# EAGLE design PaxInstruments-T100 (EAGLE 7.0.0)
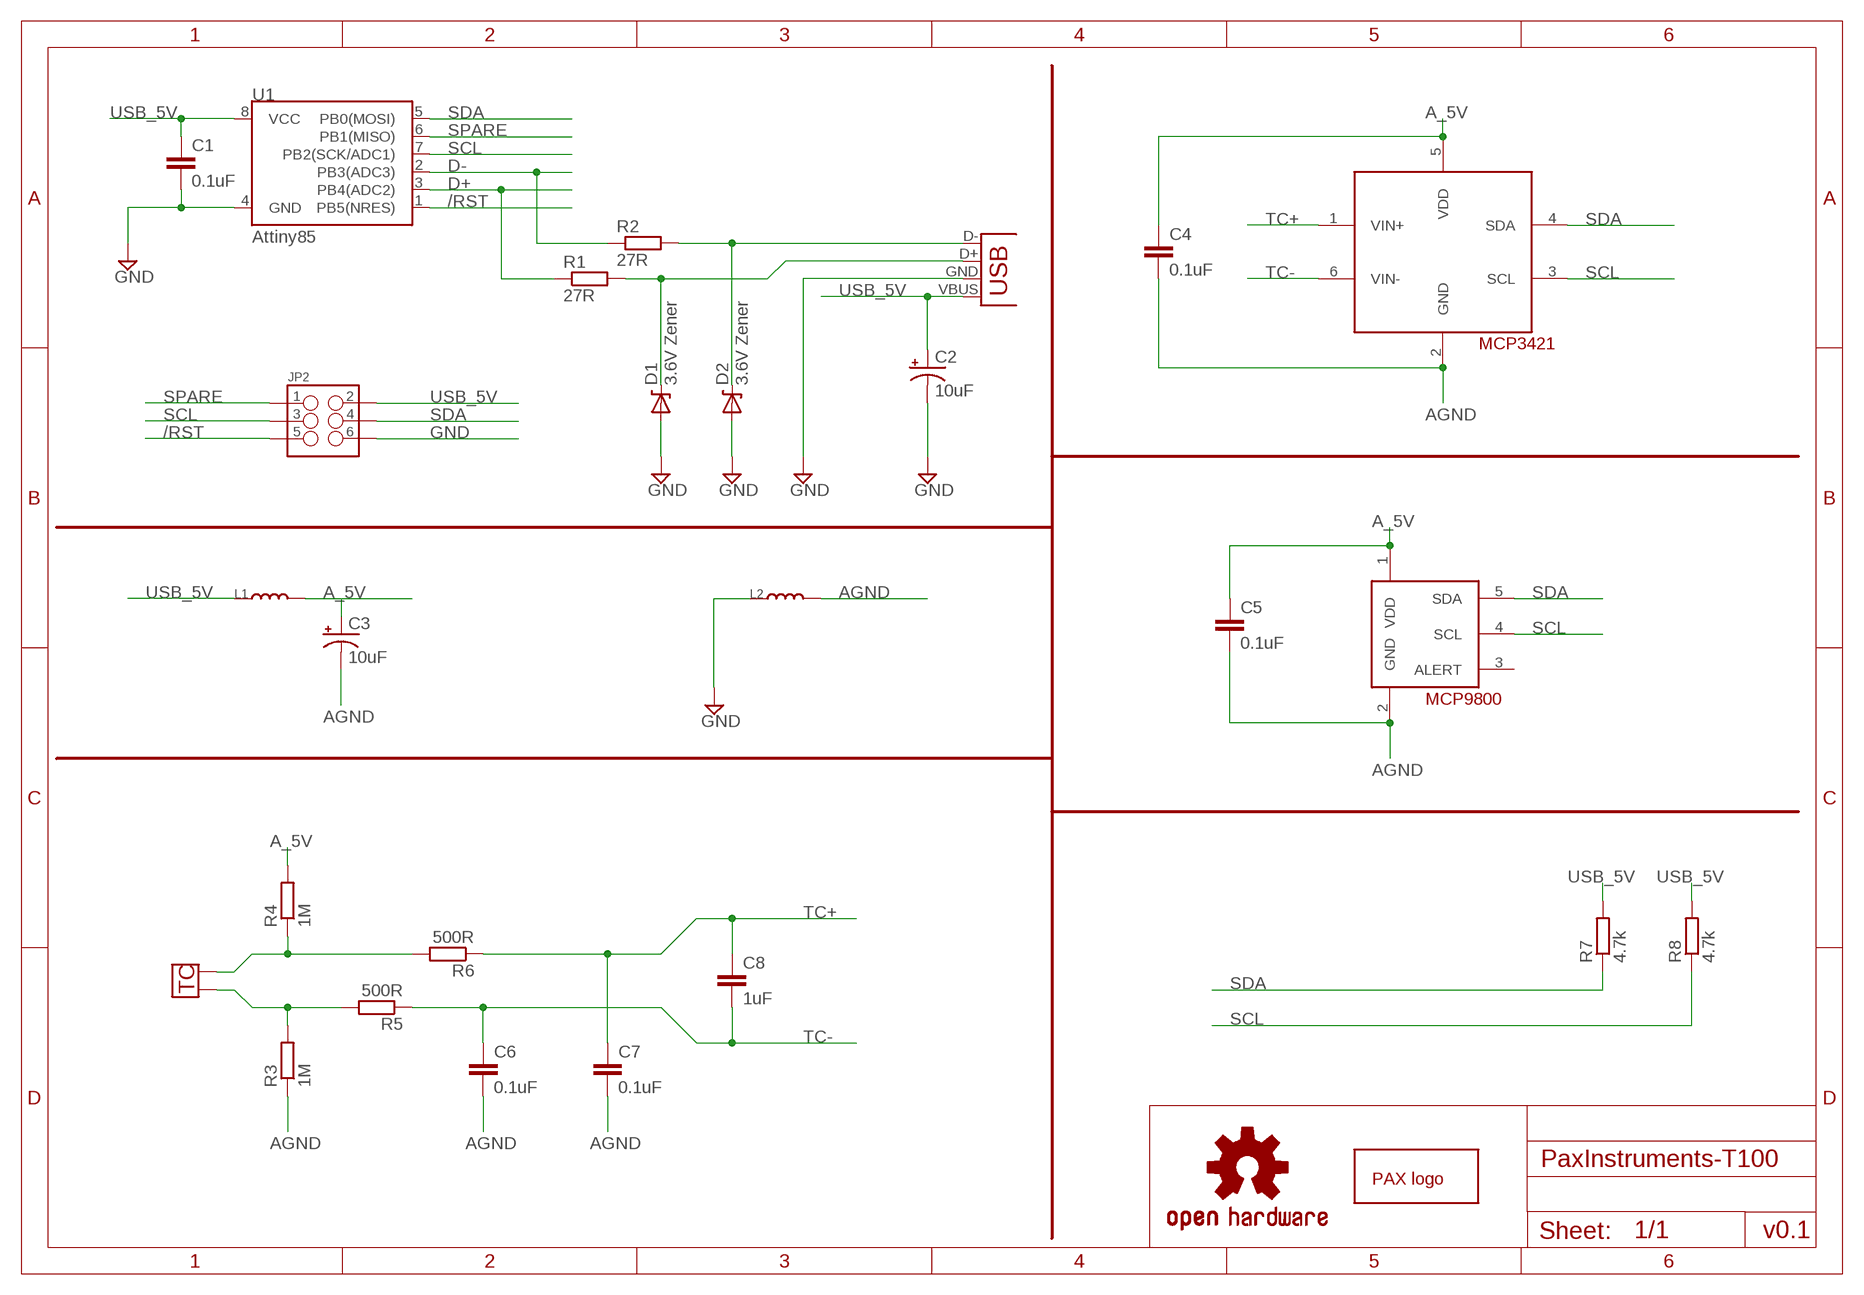
[diagram p0: schematic, sheet 1]

## Parts
C1  0.1uF  C-EUC0603  [C0603]
C2  10uF  10UF-TANT  [EIA3216]
C3  10uF  10UF-TANT  [EIA3216]
C4  0.1uF  C-EUC0603  [C0603]
C5  0.1uF  C-EUC0603  [C0603]
C6  0.1uF  C-EUC0603  [C0603]
C7  0.1uF  C-EUC0603  [C0603]
C8  1uF  C-EUC0603  [C0603]
D1  3.6V Zener  DIODE-ZENER-BZT52  [SOD-323]
D2  3.6V Zener  DIODE-ZENER-BZT52  [SOD-323]
JP1  USB-A-H  [USB-A-H]
JP2  M03X2SMT  [2X3_SMT_POSTS]
L1  L-0603  [L0603]
L2  L-0603  [L0603]
LOGO1  OSHW-LOGOS  [OSHW-LOGO-S]
R1  27R  R-EU_R0603  [R0603]
R2  27R  R-EU_R0603  [R0603]
R3  1M  R-EU_R0603  [R0603]
R4  1M  R-EU_R0603  [R0603]
R5  500R  R-EU_R0603  [R0603]
R6  500R  R-EU_R0603  [R0603]
R7  4.7k  R-EU_R0603  [R0603]
R8  4.7k  R-EU_R0603  [R0603]
U1  Attiny85  ATTINY45TINY45-20-SMT  [SO08-EIAJ]
U$1  PAX-LOGO  [PAX-LOGO]
U$2  TC-MINI-CONNECTOR  [TC-MINI-CONNECTOR]
U$3  MCP3421  [SOT23-6]
U$4  MCP9800  [SOT23-5]

## Nets
/RST: JP2.5 U1.1(PB5(NRES))
A_5V: C3.A(+) C4.1 C5.1 L1.2 R4.2 U$3.5(VDD) U$4.1(VDD)
AGND: C3.C(-) C4.2 C5.2 C6.2 C7.2 L2.2 R3.1 U$3.2(GND) U$4.2(GND)
D+: R1.1 U1.3(PB4(ADC2))
D-: R2.1 U1.2(PB3(ADC3))
GND: C1.2 C2.C(-) D1.2(A) D2.2(A) JP1.GND(VBUS) JP2.6 L2.1 U1.4(GND)
N$1: D2.1(C) JP1.D-(D+) R2.2
N$2: D1.1(C) JP1.D+(D-) R1.2
N$3: R3.2 R5.2 U$2.P$2
N$4: R4.1 R6.2 U$2.P$1
SCL: JP2.3 R8.1 U1.7(PB2(SCK/ADC1)) U$3.3(SCL) U$4.4(SCL)
SDA: JP2.4 R7.1 U1.5(PB0(MOSI)) U$3.4(SDA) U$4.5(SDA)
SPARE: JP2.1 U1.6(PB1(MISO))
TC+: C7.1 C8.1 R6.1 U$3.1(VIN+)
TC-: C6.1 C8.2 R5.1 U$3.6(VIN-)
USB_5V: C1.1 C2.A(+) JP1.VBUS(GND) JP2.2 L1.1 R7.2 R8.2 U1.8(VCC)
Unconnected: U$4.3(ALERT)

## Notes on the sheet
- v0.1

## Library data of the parts
C1 C4-C8 = rcl:C-EU: CAPACITOR, European symbol
C2 C3 = SparkFun-Capacitors:10UF-TANT: 10uF Tantalum SMT CAP-00811- 16V 10% (EIA-3216); PROD_ID: CAP-00811
D1 D2 = SparkFun-DiscreteSemi:DIODE-ZENER: Zener Diode Production Part - 8199 3.4V Zener Voltage
JP1 = SparkFun-Connectors:USB: USB Connectors USB-B-PTH is fully proven SKU : PRT-00139/CONN-08278 USB-miniB is fully proven SKU : PRT-00587 USB-A-PCB is untested. USB-A-H is throughly reviewed, but untested. Spark Fun Electronics SKU : PRT-00437 USB-B-SMT is throughly reviewed, but untested. Needs silkscreen touching up. USB-A-S has not been used/tested USB-MB-H has not been used/tested USB-MICROB has been used. CONN-09505
JP2 = SparkFun-Connectors:M03X2: 2x3 .1" header. Shrouded, with keying- CONN-10681 SMT- CONN-11415 Pogo pins- HW-11044; PROD_ID: CONN-11415
L1 L2 = SeeesStudio-OPL:L*
LOGO1 = SparkFun-Aesthetics:OSHW-LOGO: Open Source Hardware Logo This logo indicates the piece of hardware it is found on incorporates a OSHW license and/or adheres to the definition of open source hardware found here: http://freedomdefined.org/OSHW
R1-R8 = rcl:R-EU_: RESISTOR, European symbol
U1 = SparkFun-DigitalIC_ihsan:ATTINY45: Atmel 8-pin 2/4/8kB flash uC; PROD_ID: IC-08922; VALUE: Tiny45-20-SMT
U$1 = charlespax:PAX-LOGO
U$2 = charlespax:TC-MINI-CONNECTOR
U$3 = SparkFun-DigitalIC:MCP3421
U$4 = SparkFun-DigitalIC:MCP9800

## Board
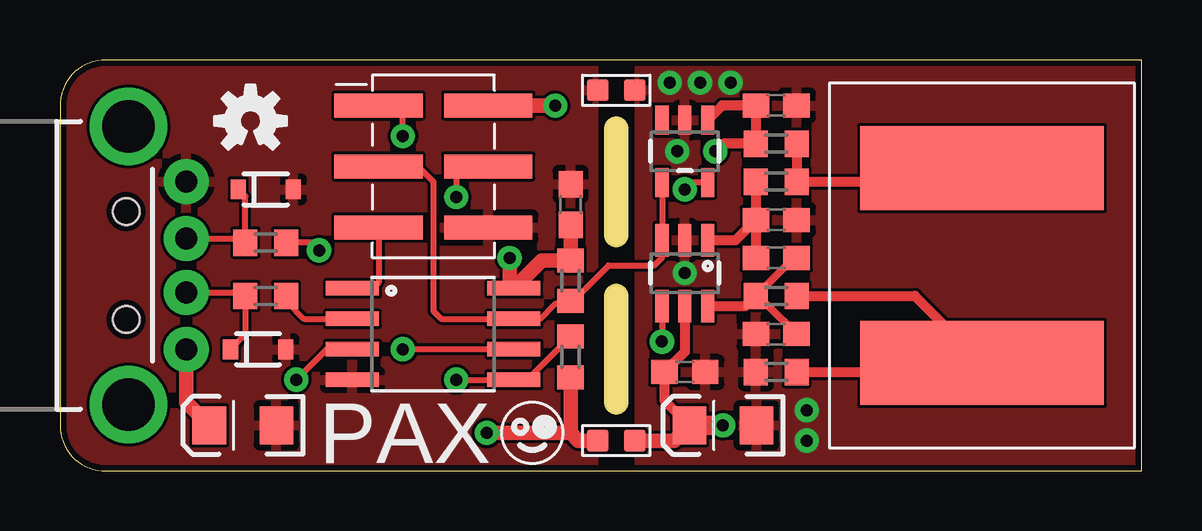
[diagram p1: board, top side]
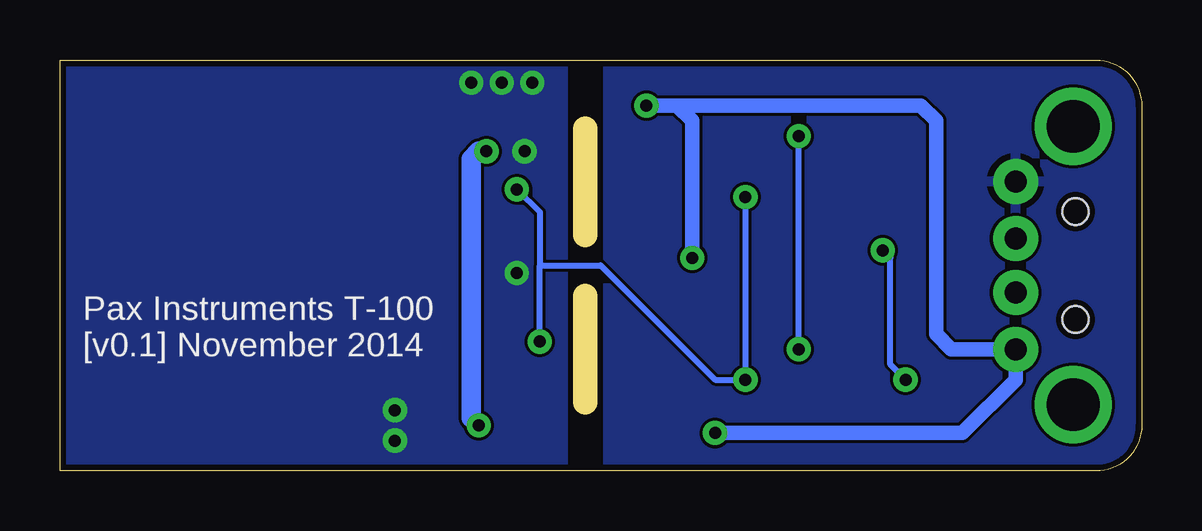
[diagram p2: board, bottom side, seen from below]

Size 45.07 x 17.14 mm. Coordinates in mm from the lower left corner, seen from the top.
Outline: 0,1.91 arc90 1.91,0 45.07,0 45.07,17.14 2.22,17.14 1.92,17.14 arc90 0,15.23 0,1.91
Copper layers (1*16): Top 0.035mm / dielectric 1.5mm / Bottom 0.035mm
Design rules "PaxInstrument-T400": minimum track width 6mil, minimum drill 13mil, track to track 5mil, track to pad 5mil, pad to pad 5mil, via to via 5mil, smd to smd 5mil, copper to edge 10mil, drill to drill 8mil, minimum pad ring 12mil, minimum via ring 10mil, stop-mask expansion 4mil, vias tented up to drill 25mil, thermal gap 10mil
Milling: 2 lines

### Footprints (pad centres in the part's own frame; a part is rotated, then mirrored left to right if it is on the bottom)
C0603 = smd 1.1 x 1: 1 -0.85,0; 2 0.85,0
EIA3216 = smd 1.4 x 1.6: A 1.4,0; C -1.4,0
SOD-323 = smd 0.63 x 0.83: 1 -1.15,0; 2 1.15,0
USB-A-H = drill 0.914 pad 1.88: D+ 2.4,1.127; D- 2.4,-1.127; GND 2.4,3.5; VBUS 2.4,-3.5 | drill 2.2: GND2 0,-5.8; GND3 0,5.8 | hole 1.1: -0.1,2.25; -0.1,-2.25
2X3_SMT_POSTS = smd 1 x 3.683: 1 -2.54,-2.286; 2 -2.54,2.286; 3 0,-2.286; 4 0,2.286; 5 2.54,-2.286; 6 2.54,2.286
L0603 = smd 0.889 x 0.889: 1 -0.762,0; 2 0.762,0
R0603 = smd 1 x 1.1: 1 -0.85,0; 2 0.85,0
SO08-EIAJ = smd 0.61 x 2.21: 1 -1.905,-3.378; 2 -0.635,-3.378; 3 0.635,-3.378; 4 1.905,-3.378; 5 1.905,3.353; 6 0.635,3.353; 7 -0.635,3.353; 8 -1.905,3.353
TC-MINI-CONNECTOR = smd 3.505 x 10.16: P$1 4.064,0; P$2 -4.064,0
SOT23-6 = smd 0.55 x 1.35: 1 -0.95,-1.375; 2 0,-1.375; 3 0.95,-1.375; 4 0.95,1.375; 5 0,1.375; 6 -0.95,1.375
SOT23-5 = smd 0.55 x 1.2: 1 -0.95,-1.3; 2 0,-1.3; 3 0.95,-1.3; 4 0.95,1.3; 5 -0.95,1.3

### Placement (x,y rotation side)
C1  21.27,11.11 90 top
C2  7.62,1.91 180 top
C3  27.62,1.91 180 top
C4  26.04,4.13 0 top
C5  29.84,15.24 0 top
C6  29.84,5.71 180 top
C7  29.84,10.48 0 top
C8  29.84,8.89 0 top
D1  8.57,11.75 0 top
D2  8.26,5.08 0 top
JP1  2.86,8.57 0 top
JP2  15.56,12.7 270 top
L1  23.18,1.27 0 top
L2  23.18,15.88 0 top
LOGO1  7.94,14.61 0 top
R1  8.57,9.53 180 top
R2  8.57,7.3 180 top
R3  29.84,4.13 0 top
R4  29.84,13.65 180 top
R5  29.84,7.3 0 top
R6  29.84,12.06 0 top
R7  21.27,4.76 270 top
R8  21.27,7.94 90 top
U1  15.56,5.71 270 top
U$1  10.79,0.32 0 top
U$2  38.42,8.57 90 top
U$3  26.04,8.26 180 top
U$4  26.04,13.34 180 top

### Tracks (layer width: path | path; a pad name or v marks a point on that pad's centre or on a via)
/RST
  Top 0.254: JP2.5 13.27,7.87 13.02,7.62 U1.1
A_5V  (via drill 0.5)
  Top 0.406: U$3.5 26.04,4.98 C4.1 25.18,2.94 C3.A | U$4.1 27.59,15.24 C5.1 R4.2 27.62,13.65 v27.3,13.34
  Top 0.61: L1.2 25.59,1.27 C3.A
  Top 0.813: v27.62,1.91 C3.A
  Bottom 0.813: v27.3,13.34 27.62,13.34 27.94,13.02 27.94,2.22 v27.62,1.91
AGND  (via drill 0.5)
  other vias: 26.04,8.26 25.72,13.34 25.4,16.19 31.11,1.27 31.11,2.54 26.67,16.19 27.94,16.19
  pour Top: 24.13,17.14 24.13,0 45.09,0 45.09,17.14
  pour Bottom: 24.13,17.14 24.13,0 45.09,0 45.09,17.14
D+  (via drill 0.5)
  Top 0.254: U1.3 11.11,5.08 v9.84,3.81 | v10.79,9.21 10.48,9.53 R1.1
  Bottom 0.254: v9.84,3.81 10.48,4.45 10.48,8.89 v10.79,9.21
D-
  Top 0.254: R2.1 9.42,7.09 10.16,6.35 U1.2
GND
  pour Bottom: 0,17.14 0,0 22.23,0 22.23,17.14
  pour Top: 0,17.14 22.23,17.14 22.23,0 0,0
N$1
  Top 0.254: JP1.D- 7.58,7.45 R2.2 7.72,5.7 D2.1
N$2
  Top 0.254: D1.1 7.72,11.45 R1.2 7.55,9.7 JP1.D+
N$3
  Top 0.406: R5.2 35.62,7.3 U$2.P$2 38.04,4.13 R3.2
N$4
  Top 0.406: 38.99,13.34 U$2.P$1 37.85,12.06 R6.2 R4.1
SCL
  Top 0.254: JP2.3 14.92,12.7 15.56,12.06 15.56,6.67 15.88,6.35 U1.7 20,6.35 20.64,6.99 21.17,6.99 R8.1 21.38,7.09 22.86,8.57 24.77,8.57 25.08,8.89 U$3.3 U$4.4
SDA  (via drill 0.5)
  Top 0.254: JP2.4 16.83,12.7 16.51,12.38 v16.51,11.43 | v16.51,3.81 U1.5 19.47,3.81 R7.1 | U$3.4 25.09,6.04 25.08,5.71 v25.08,5.4 | U$4.5 26.32,12.04 v26.04,11.75
  Bottom 0.254: v16.51,11.43 v16.51,3.81 17.78,3.81 22.54,8.57 25.08,8.57 | v25.08,5.4 25.08,8.57 | v26.04,11.75 25.08,10.79 25.08,8.57
SPARE  (via drill 0.5)
  Top 0.254: U1.6 v14.29,5.08 | v14.29,13.97 14.29,15.24 JP2.1
  Bottom 0.254: v14.29,5.08 v14.29,13.97
TC+
  Top 0.406: R6.1 C7.1 | C7.1 C8.1 | U$3.1 28.15,9.63 C7.1
TC-
  Top 0.305: C8.2 30.58,8.89 R5.1 | 28.63,6.93 29.48,6.93 C6.1
  Top 0.406: U$3.6 28.57,6.88 28.63,6.93 R5.1
USB_5V  (via drill 0.5)
  Top 0.61: C1.1 R8.2 20.08,8.79 U1.8 18.73,7.62 v18.73,8.89 | JP1.VBUS 5.26,2.87 C2.A | L1.1 21.59,1.27 21.27,1.59 | 21.27,1.59 v17.78,1.59 | JP2.2 v20.64,15.24 | R7.2 21.27,1.59
  Bottom 0.61: v17.78,1.59 7.48,1.59 5.26,3.81 JP1.VBUS 7.94,5.08 8.57,5.71 8.57,14.61 9.21,15.24 19.37,15.24 | v20.64,15.24 19.37,15.24 | v18.73,8.89 18.73,14.61 19.37,15.24

### Text on the board
bNames: Pax Instruments T-100 / [v0.1] November 2014